# EAGLE design main (EAGLE 7.5.0)
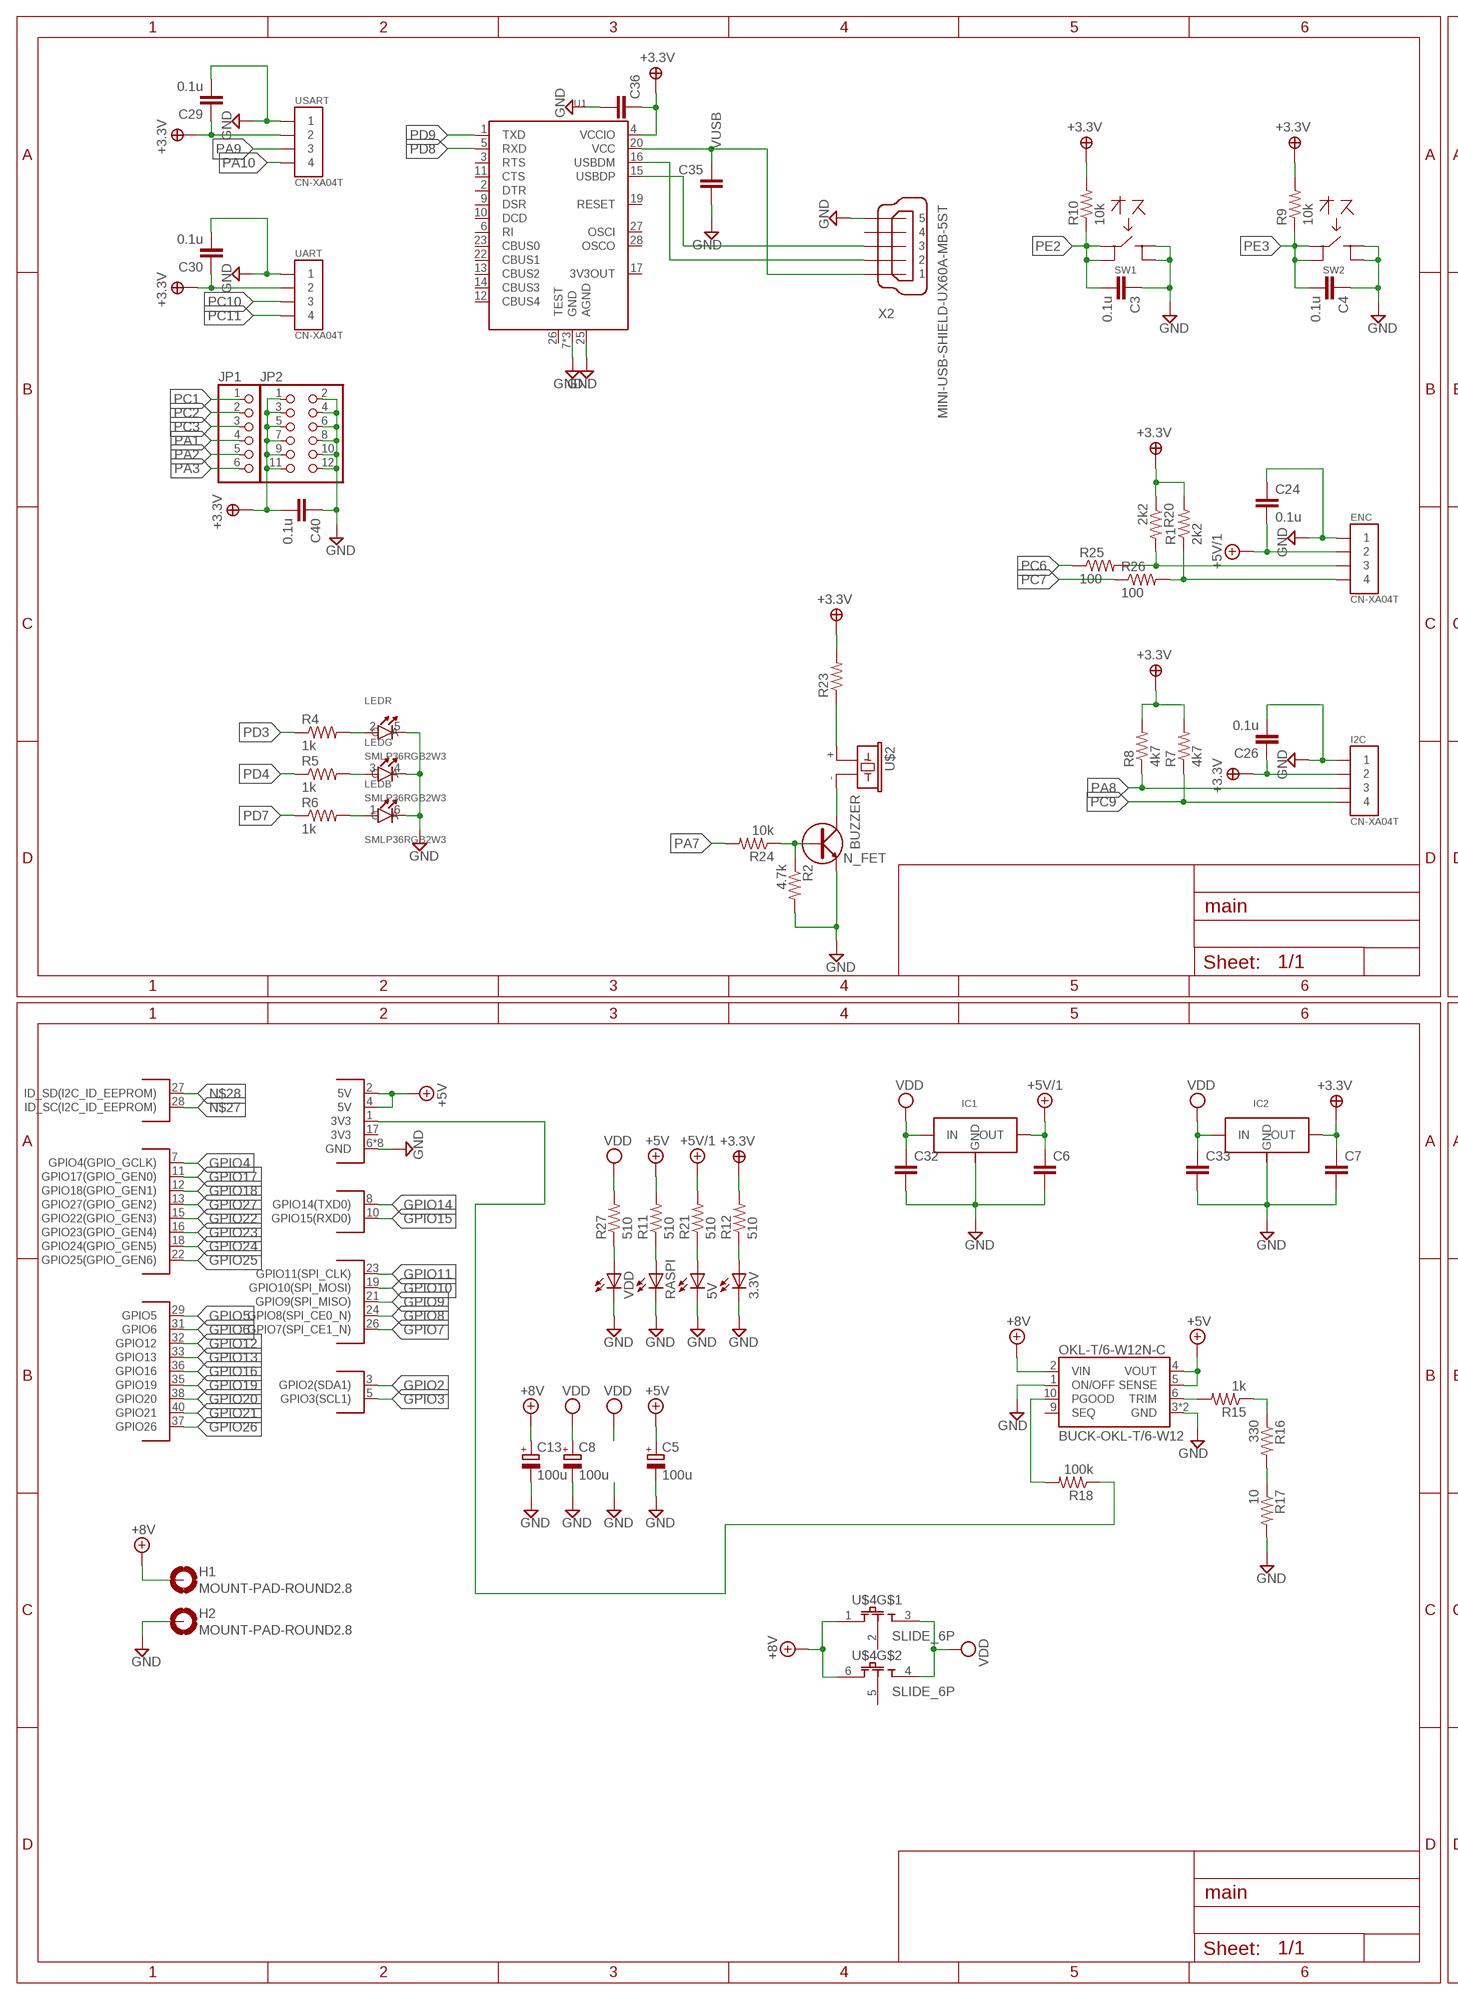
[diagram p0: schematic, sheet 1, part 1 of 2]
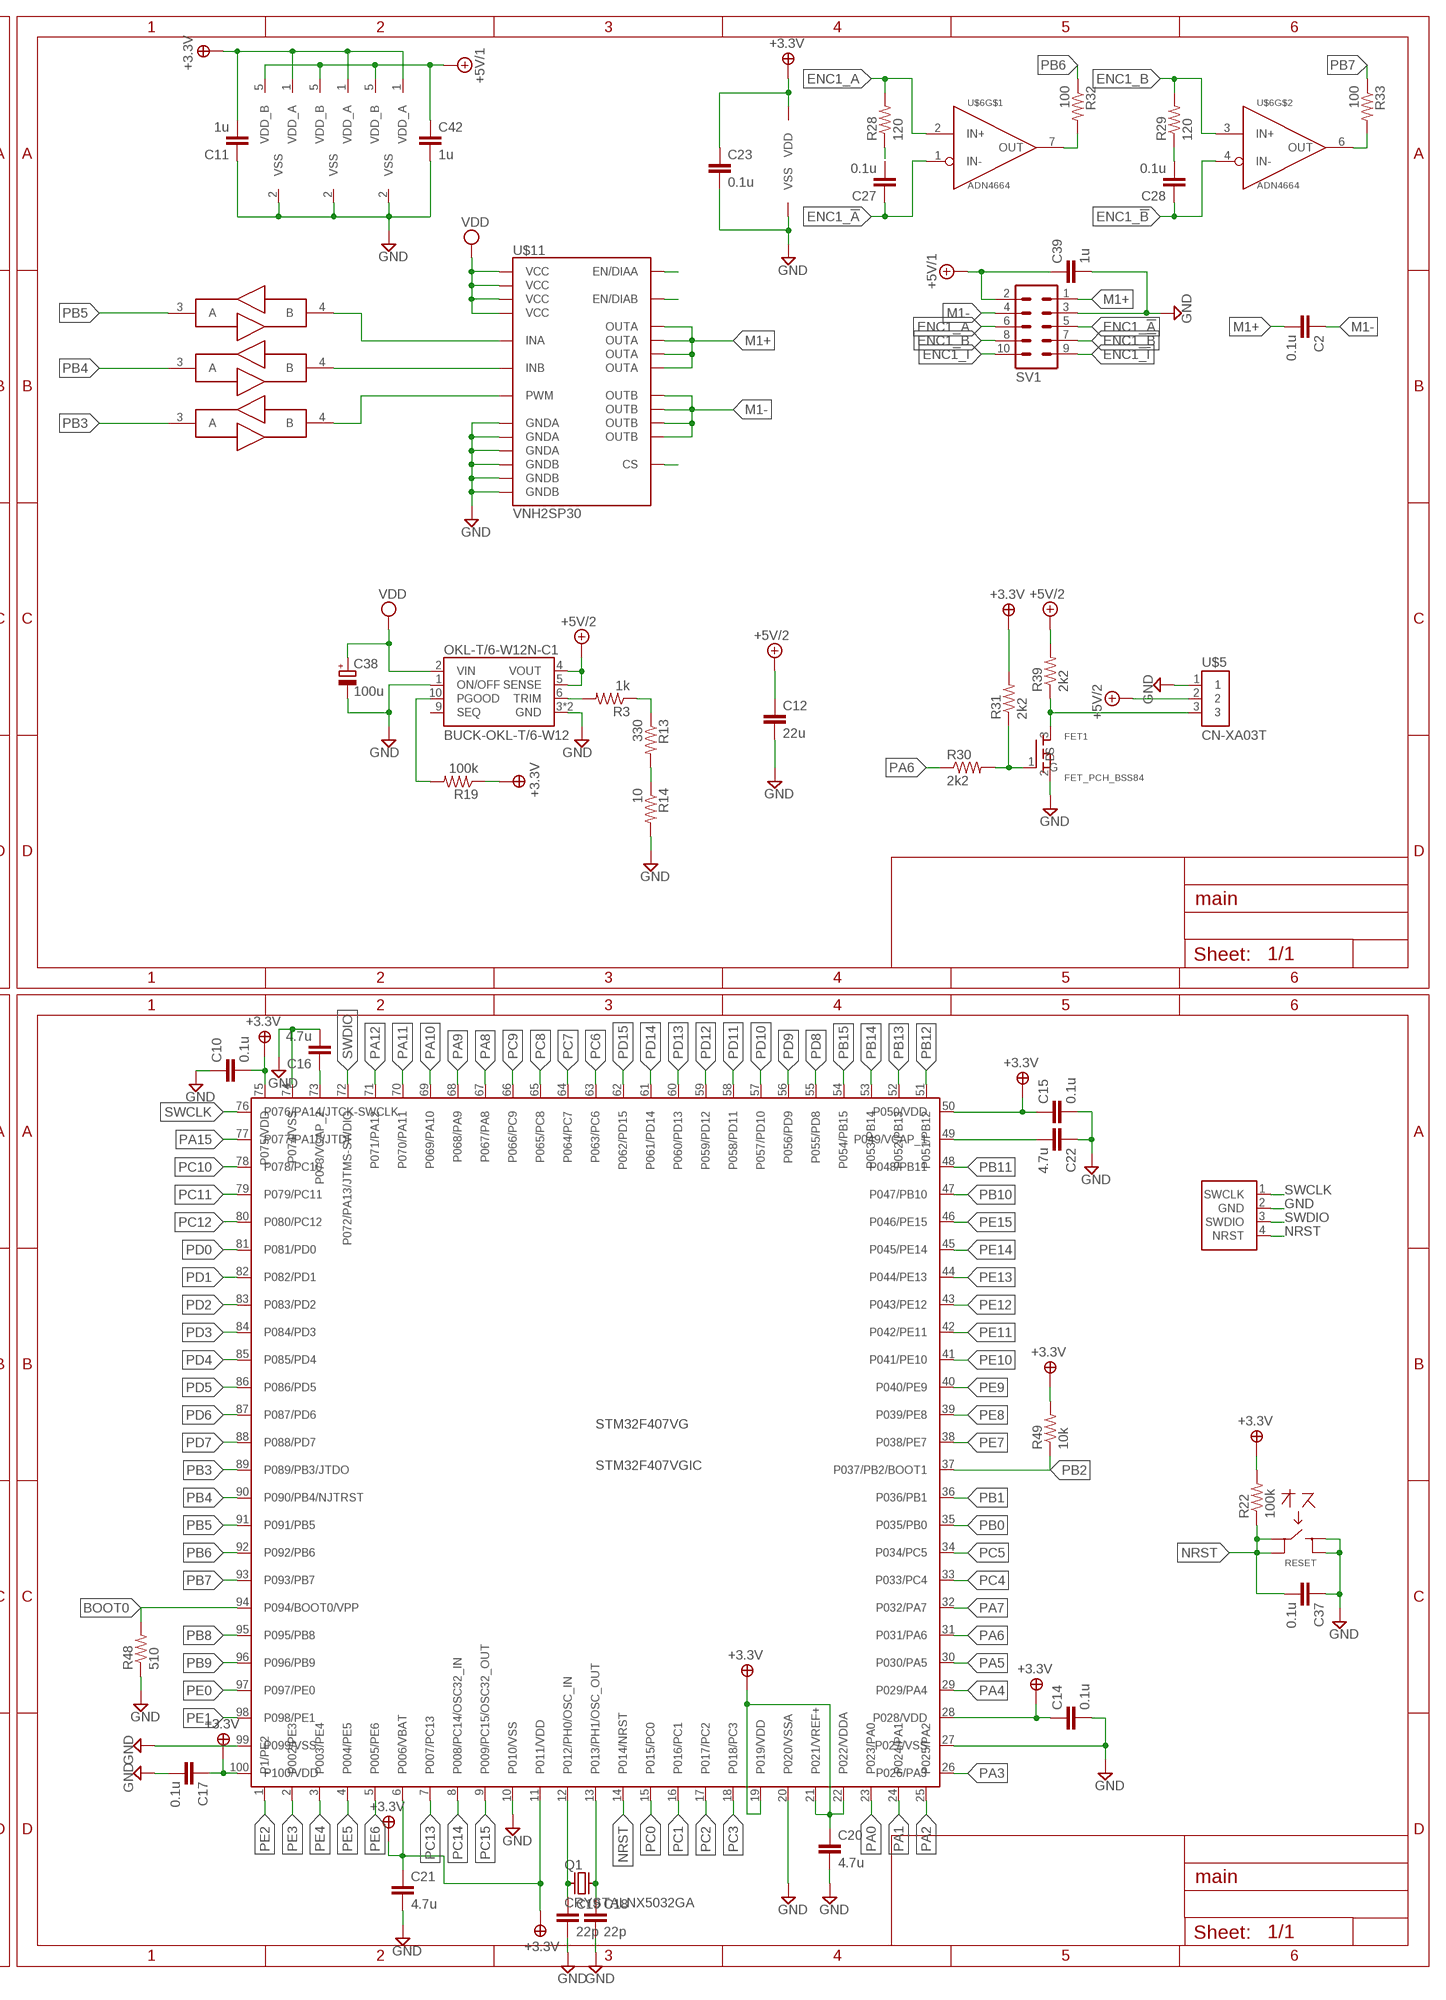
[diagram p1: schematic, sheet 1, part 2 of 2]

## Parts
3.3V  LEDCHIPLED_0603  [CHIPLED_0603]
5V  LEDCHIPLED_0603  [CHIPLED_0603]
C2  0.1u  C-EUC0603K  [C0603K]
C3  0.1u  C-EUC0603K  [C0603K]
C4  0.1u  C-EUC0603K  [C0603K]
C5  100u  CPOL-EUC  [PANASONIC_C]
C6  C-EUC0805K  [C0805K]
C7  C-EUC0805K  [C0805K]
C8  100u  CPOL-EUD  [PANASONIC_D]
C10  0.1u  C-EUC0603K  [C0603K]
C11  1u  C-EUC0603K  [C0603K]
C12  22u  C-EUC0805K  [C0805K]
C13  100u  CPOL-EUC  [PANASONIC_C]
C14  0.1u  C-EUC0603K  [C0603K]
C15  0.1u  C-EUC0603K  [C0603K]
C16  4.7u  C-EUC0805K  [C0805K]
C17  0.1u  C-EUC0603K  [C0603K]
C18  22p  C-EUC0603K  [C0603K]
C19  22p  C-EUC0603K  [C0603K]
C20  4.7u  C-EUC0805K  [C0805K]
C21  4.7u  C-EUC0805K  [C0805K]
C22  4.7u  C-EUC0805K  [C0805K]
C23  0.1u  C-EUC0603K  [C0603K]
C24  0.1u  C-EUC0805  [C0805]
C26  0.1u  C-EUC0805  [C0805]
C27  0.1u  C-EUC0603K  [C0603K]
C28  0.1u  C-EUC0603K  [C0603K]
C29  0.1u  C-EUC0805  [C0805]
C30  0.1u  C-EUC0805  [C0805]
C32  C-EUC0805K  [C0805K]
C33  C-EUC0805K  [C0805K]
C35  C-EUC0603K  [C0603K]
C36  C-EUC0603K  [C0603K]
C37  0.1u  C-EUC0603K  [C0603K]
C38  100u  CPOL-EUD  [PANASONIC_D]
C39  1u  C-EUC0603K  [C0603K]
C40  0.1u  C-EUC0805K  [C0805K]
C42  1u  C-EUC0603K  [C0603K]
ENC  CN-XA04T  [XA04]
FET1  FET_PCH_BSS84  [SOT-23-3]
H1  MOUNT-PAD-ROUND2.8  [2,8-PAD]
H2  MOUNT-PAD-ROUND2.8  [2,8-PAD]
I2C  CN-XA04T  [XA04]
IC1  REGULATERLM1058  [SOT-223]
IC2  REGULATERLM1058  [SOT-223]
JP1  PINHD-1X06_2.54-S  [1X06-S]
JP2  PINHD-2X06_2.54  [2X06]
LED  SMLP36RGB2W3  [0604(6PIN)]
N_FET  TR_NTR  [SOT-23-3]
OKL-T/6-W12N-C  BUCK-OKL-T/6-W12  [BUCK-OKL-T/6-W12]
OKL-T/6-W12N-C1  BUCK-OKL-T/6-W12  [BUCK-OKL-T/6-W12]
Q1  CRYSTALNX5032GA  [NX5032GA]
R1  2k2  R-US_R0603  [R0603]
R2  4.7k  R-US_R0603  [R0603]
R3  1k  R-US_R0603  [R0603]
R4  1k  R-US_R0402  [R0402]
R5  1k  R-US_R0402  [R0402]
R6  1k  R-US_R0402  [R0402]
R7  4k7  R-US_R0603  [R0603]
R8  4k7  R-US_R0603  [R0603]
R9  10k  R-US_R0603  [R0603]
R10  10k  R-US_R0603  [R0603]
R11  510  R-US_R0603  [R0603]
R12  510  R-US_R0603  [R0603]
R13  330  R-US_R0603  [R0603]
R14  10  R-US_R0603  [R0603]
R15  1k  R-US_R0603  [R0603]
R16  330  R-US_R0603  [R0603]
R17  10  R-US_R0603  [R0603]
R18  100k  R-US_R0603  [R0603]
R19  100k  R-US_R0603  [R0603]
R20  2k2  R-US_R0603  [R0603]
R21  510  R-US_R0603  [R0603]
R22  100k  R-US_R0603  [R0603]
R23  R-US_R0603  [R0603]
R24  10k  R-US_R0603  [R0603]
R25  100  R-US_R0603  [R0603]
R26  100  R-US_R0603  [R0603]
R27  510  R-US_R0603  [R0603]
R28  120  R-US_R0603  [R0603]
R29  120  R-US_R0603  [R0603]
R30  2k2  R-US_R0603  [R0603]
R31  2k2  R-US_R0603  [R0603]
R32  100  R-US_R0603  [R0603]
R33  100  R-US_R0603  [R0603]
R39  2k2  R-US_R0603  [R0603]
R48  510  R-US_R0603  [R0603]
R49  10k  R-US_R0603  [R0603]
RASPI  LEDCHIPLED_0603  [CHIPLED_0603]
RESET  SWITCH_4PALPS  [SKRP]
STM32F407VG  STM32F407VGIC  [LQFP100]
SV1  ML10_T  [ML10]
SW1  SWITCH_4PALPS  [SKRP]
SW2  SWITCH_4PALPS  [SKRP]
U1  FT232RL  [SSOP28]
U$1  RASPBERRY_PAI2_B  [PAI_2_B_RS]
U$2  BUZZER  [SMT-0440-S-R]
U$3  WRITE_FOR_STM32FXT  [ZH05]
U$4  SLIDE_6P  [SSW-SMD]
U$5  CN-XA03T  [XA03]
U$6  ADN4664  [SOIC8]
U$7  MAX3370  [SOT-353/SC-70-5]
U$9  MAX3370  [SOT-353/SC-70-5]
U$10  MAX3370  [SOT-353/SC-70-5]
U$11  VNH2SP30  [VNH2SP30]
UART  CN-XA04T  [XA04]
USART  CN-XA04T  [XA04]
VDD  LEDCHIPLED_0603  [CHIPLED_0603]
X2  MINI-USB-SHIELD-UX60A-MB-5ST  [UX60A-MB-5ST]

## Nets
3.3V: C7.1 C10.2 C11.2 C14.1 C15.1 C17.1 C20.1 C21.1 C23.1 C26.1 C29.1 C30.1 C36.1 C40.2 I2C.PIN2 IC2.2(OUT) IC2.4(OUT) JP2.1 JP2.3 JP2.5 JP2.7 JP2.9 JP2.11 R1.2 R7.2 R8.2 R9.2 R10.2 R12.2 R19.1 R20.1 R22.2 R23.2 R31.2 R49.2 STM32F407VG.6(P006/VBAT) STM32F407VG.11(P011/VDD) STM32F407VG.19(P019/VDD) STM32F407VG.21(P021/VREF+) STM32F407VG.22(P022/VDDA) STM32F407VG.28(P028/VDD) STM32F407VG.50(P050/VDD) STM32F407VG.75(P075/VDD) STM32F407VG.100(P100/VDD) U1.4(VCCIO) U$6.8(VDD) U$7.1(VDD_A) U$9.1(VDD_A) U$10.1(VDD_A) UART.PIN2 USART.PIN2 ; supply symbol labelled +3.3V
+5V: C5.+ OKL-T/6-W12N-C.4(VOUT) OKL-T/6-W12N-C.5(SENSE) R11.2 U$1.2(5V) U$1.4(5V)
+5V/1: C6.1 C24.2 C39.1 C42.1 ENC.PIN2 IC1.2(OUT) IC1.4(OUT) R21.2 SV1.2 U$7.5(VDD_B) U$9.5(VDD_B) U$10.5(VDD_B)
+5V/2: C12.1 OKL-T/6-W12N-C1.4(VOUT) OKL-T/6-W12N-C1.5(SENSE) R39.2 U$5.2
+8V: C13.+ H1.B2,8(MOUNT) OKL-T/6-W12N-C.2(VIN) U$4.1 U$4.6
BOOT0: R48.2 STM32F407VG.94(P094/BOOT0/VPP)
ENC1_!A: C27.1 SV1.5 U$6.1(IN-)
ENC1_!B: C28.1 SV1.7 U$6.4(IN-)
ENC1_!I: SV1.9
ENC1_A: R28.2 SV1.6 U$6.2(IN+)
ENC1_B: R29.2 SV1.8 U$6.3(IN+)
ENC1_I: SV1.10
GND: 3.3V.C 5V.C C3.1 C4.1 C5.- C6.2 C7.2 C8.- C10.1 C11.1 C12.2 C13.- C14.2 C15.2 C16.2 C17.2 C18.2 C19.2 C20.2 C21.2 C22.1 C23.2 C24.1 C26.2 C29.2 C30.2 C32.2 C33.2 C35.2 C36.2 C37.1 C38.- C39.2 C40.1 C42.2 ENC.PIN1 FET1.2(S) H2.B2,8(MOUNT) I2C.PIN1 IC1.1(GND) IC2.1(GND) JP2.2 JP2.4 JP2.6 JP2.8 JP2.10 JP2.12 LED.4(G:C) LED.5(R:C) LED.6(B:C) N_FET.2(E) OKL-T/6-W12N-C1.1(ON/OFF) OKL-T/6-W12N-C1.3(GND) OKL-T/6-W12N-C1.7(GND) OKL-T/6-W12N-C.1(ON/OFF) OKL-T/6-W12N-C.3(GND) OKL-T/6-W12N-C.7(GND) R2.2 R14.2 R17.2 R48.1 RASPI.C RESET.3 RESET.4 STM32F407VG.10(P010/VSS) STM32F407VG.20(P020/VSSA) STM32F407VG.27(P027/VSS) STM32F407VG.74(P074/VSS) STM32F407VG.99(P099/VSS) SV1.3 SW1.3 SW1.4 SW2.3 SW2.4 U1.7(GND) U1.18(GND) U1.21(GND) U1.25(AGND) U$1.6(GND) U$1.9(GND) U$1.14(GND) U$1.20(GND) U$1.25(GND) U$1.30(GND) U$1.34(GND) U$1.39(GND) U$3.2(GND) U$5.1 U$6.5(VSS) U$7.2(VSS) U$9.2(VSS) U$10.2(VSS) U$11.18(GNDB) U$11.19(GNDB) U$11.20(GNDB) U$11.26(GNDA) U$11.27(GNDA) U$11.28(GNDA) UART.PIN1 USART.PIN1 VDD.C X2.5
GPIO2: U$1.3(GPIO2(SDA1))
GPIO3: U$1.5(GPIO3(SCL1))
GPIO4: U$1.7(GPIO4(GPIO_GCLK))
GPIO5: U$1.29(GPIO5)
GPIO6: U$1.31(GPIO6)
GPIO7: U$1.26(GPIO7(SPI_CE1_N))
GPIO8: U$1.24(GPIO8(SPI_CE0_N))
GPIO9: U$1.21(GPIO9(SPI_MISO))
GPIO10: U$1.19(GPIO10(SPI_MOSI))
GPIO11: U$1.23(GPIO11(SPI_CLK))
GPIO12: U$1.32(GPIO12)
GPIO13: U$1.33(GPIO13)
GPIO14: U$1.8(GPIO14(TXD0))
GPIO15: U$1.10(GPIO15(RXD0))
GPIO16: U$1.36(GPIO16)
GPIO17: U$1.11(GPIO17(GPIO_GEN0))
GPIO18: U$1.12(GPIO18(GPIO_GEN1))
GPIO19: U$1.35(GPIO19)
GPIO20: U$1.38(GPIO20)
GPIO21: U$1.40(GPIO21)
GPIO22: U$1.15(GPIO22(GPIO_GEN3))
GPIO23: U$1.16(GPIO23(GPIO_GEN4))
GPIO24: U$1.18(GPIO24(GPIO_GEN5))
GPIO25: U$1.22(GPIO25(GPIO_GEN6))
GPIO26: U$1.37(GPIO26)
GPIO27: U$1.13(GPIO27(GPIO_GEN2))
M1+: C2.2 SV1.1 U$11.1(OUTA) U$11.25(OUTA) U$11.30(OUTA) U$11.SLUG3(OUTA)
M1-: C2.1 SV1.4 U$11.15(OUTB) U$11.16(OUTB) U$11.21(OUTB) U$11.SLUG2(OUTB)
N$1: ENC.PIN3 R20.2 R25.2
N$2: OKL-T/6-W12N-C1.6(TRIM) R3.2
N$3: LED.2(R:A) R4.2
N$4: LED.3(G:A) R5.2
N$5: LED.1(B:A) R6.2
N$6: N_FET.3(C) U$2.-
N$7: C16.1 STM32F407VG.73(P073/VCAP_2)
N$8: R23.1 U$2.+
N$9: R11.1 RASPI.A
N$10: R3.1 R13.1
N$11: N_FET.1(B) R2.1 R24.1
N$12: C27.2 R28.1
N$13: OKL-T/6-W12N-C.6(TRIM) R15.2
N$14: R13.2 R14.1
N$15: 3.3V.A R12.1
N$17: U$7.4(B) U$11.8(PWM)
N$18: U1.15(USBDP) X2.3
N$19: ENC.PIN4 R1.1 R26.2
N$20: U1.16(USBDM) X2.2
N$21: R15.1 R16.1
N$22: U$9.4(B) U$11.11(INB)
N$23: R16.2 R17.1
N$24: OKL-T/6-W12N-C.10(PGOOD) R18.2
N$25: C22.2 STM32F407VG.49(P049/VCAP_1)
N$26: 5V.A R21.1
N$27: U$1.28(ID_SC(I2C_ID_EEPROM))
N$28: U$1.27(ID_SD(I2C_ID_EEPROM))
N$29: R27.1 VDD.A
N$30: C28.2 R29.1
N$31: OKL-T/6-W12N-C1.10(PGOOD) R19.2
N$32: U$10.4(B) U$11.5(INA)
N$33: FET1.3(D) R39.1 U$5.3
N$34: U$11.9(CS)
N$37: FET1.1(G) R30.2 R31.1
N$40: R18.1 U$1.1(3V3)
N$41: U$11.10(EN/DIAB)
N$42: U$11.6(EN/DIAA)
N$47: R32.2 U$6.7(OUT)
N$48: R33.2 U$6.6(OUT)
NRST: C37.2 R22.1 RESET.1 RESET.2 STM32F407VG.14(P014/NRST) U$3.4(NRST)
PA0: STM32F407VG.23(P023/PA0)
PA1: JP1.4 STM32F407VG.24(P024/PA1)
PA2: JP1.5 STM32F407VG.25(P025/PA2)
PA3: JP1.6 STM32F407VG.26(P026/PA3)
PA4: STM32F407VG.29(P029/PA4)
PA5: STM32F407VG.30(P030/PA5)
PA6: R30.1 STM32F407VG.31(P031/PA6)
PA7: R24.2 STM32F407VG.32(P032/PA7)
PA8: I2C.PIN3 R8.1 STM32F407VG.67(P067/PA8)
PA9: STM32F407VG.68(P068/PA9) USART.PIN3
PA10: STM32F407VG.69(P069/PA10) USART.PIN4
PA11: STM32F407VG.70(P070/PA11)
PA12: STM32F407VG.71(P071/PA12)
PA15: STM32F407VG.77(P077/PA15/JTDI)
PB0: STM32F407VG.35(P035/PB0)
PB1: STM32F407VG.36(P036/PB1)
PB2: R49.1 STM32F407VG.37(P037/PB2/BOOT1)
PB3: STM32F407VG.89(P089/PB3/JTDO) U$7.3(A)
PB4: STM32F407VG.90(P090/PB4/NJTRST) U$9.3(A)
PB5: STM32F407VG.91(P091/PB5) U$10.3(A)
PB6: R32.1 STM32F407VG.92(P092/PB6)
PB7: R33.1 STM32F407VG.93(P093/PB7)
PB8: STM32F407VG.95(P095/PB8)
PB9: STM32F407VG.96(P096/PB9)
PB10: STM32F407VG.47(P047/PB10)
PB11: STM32F407VG.48(P048/PB11)
PB12: STM32F407VG.51(P051/PB12)
PB13: STM32F407VG.52(P052/PB13)
PB14: STM32F407VG.53(P053/PB14)
PB15: STM32F407VG.54(P054/PB15)
PC0: STM32F407VG.15(P015/PC0)
PC1: JP1.1 STM32F407VG.16(P016/PC1)
PC2: JP1.2 STM32F407VG.17(P017/PC2)
PC3: JP1.3 STM32F407VG.18(P018/PC3)
PC4: STM32F407VG.33(P033/PC4)
PC5: STM32F407VG.34(P034/PC5)
PC6: R25.1 STM32F407VG.63(P063/PC6)
PC7: R26.1 STM32F407VG.64(P064/PC7)
PC8: STM32F407VG.65(P065/PC8)
PC9: I2C.PIN4 R7.1 STM32F407VG.66(P066/PC9)
PC10: STM32F407VG.78(P078/PC10) UART.PIN3
PC11: STM32F407VG.79(P079/PC11) UART.PIN4
PC12: STM32F407VG.80(P080/PC12)
PC13: STM32F407VG.7(P007/PC13)
PC14: STM32F407VG.8(P008/PC14/OSC32_IN)
PC15: STM32F407VG.9(P009/PC15/OSC32_OUT)
PD0: STM32F407VG.81(P081/PD0)
PD1: STM32F407VG.82(P082/PD1)
PD2: STM32F407VG.83(P083/PD2)
PD3: R4.1 STM32F407VG.84(P084/PD3)
PD4: R5.1 STM32F407VG.85(P085/PD4)
PD5: STM32F407VG.86(P086/PD5)
PD6: STM32F407VG.87(P087/PD6)
PD7: R6.1 STM32F407VG.88(P088/PD7)
PD8: STM32F407VG.55(P055/PD8) U1.5(RXD)
PD9: STM32F407VG.56(P056/PD9) U1.1(TXD)
PD10: STM32F407VG.57(P057/PD10)
PD11: STM32F407VG.58(P058/PD11)
PD12: STM32F407VG.59(P059/PD12)
PD13: STM32F407VG.60(P060/PD13)
PD14: STM32F407VG.61(P061/PD14)
PD15: STM32F407VG.62(P062/PD15)
PE0: STM32F407VG.97(P097/PE0)
PE1: STM32F407VG.98(P098/PE1)
PE2: C3.2 R10.1 STM32F407VG.1(P1/PE2) SW1.1 SW1.2
PE3: C4.2 R9.1 STM32F407VG.2(P002/PE3) SW2.1 SW2.2
PE4: STM32F407VG.3(P003/PE4)
PE5: STM32F407VG.4(P004/PE5)
PE6: STM32F407VG.5(P005/PE6)
PE7: STM32F407VG.38(P038/PE7)
PE8: STM32F407VG.39(P039/PE8)
PE9: STM32F407VG.40(P040/PE9)
PE10: STM32F407VG.41(P041/PE10)
PE11: STM32F407VG.42(P042/PE11)
PE12: STM32F407VG.43(P043/PE12)
PE13: STM32F407VG.44(P044/PE13)
PE14: STM32F407VG.45(P045/PE14)
PE15: STM32F407VG.46(P046/PE15)
PH0: C19.1 Q1.1 STM32F407VG.12(P012/PH0/OSC_IN)
PH1: C18.1 Q1.2 STM32F407VG.13(P013/PH1/OSC_OUT)
SWCLK: STM32F407VG.76(P076/PA14/JTCK-SWCLK) U$3.1(SWCLK)
SWDIO: STM32F407VG.72(P072/PA13/JTMS-SWDIO) U$3.3(SWDIO)
VDD: C8.+ C32.1 C33.1 C38.+ IC1.3(IN) IC2.3(IN) OKL-T/6-W12N-C1.2(VIN) R27.2 U$4.3 U$4.4 U$11.3(VCC) U$11.13(VCC) U$11.23(VCC) U$11.SLUG1(VCC)
VUSB: C35.1 U1.20(VCC) X2.1
Unconnected: OKL-T/6-W12N-C1.9(SEQ) OKL-T/6-W12N-C.9(SEQ) U1.2(DTR) U1.3(RTS) U1.6(RI) U1.9(DSR) U1.10(DCD) U1.11(CTS) U1.12(CBUS4) U1.13(CBUS2) U1.14(CBUS3) U1.17(3V3OUT) U1.19(RESET) U1.22(CBUS1) U1.23(CBUS0) U1.26(TEST) U1.27(OSCI) U1.28(OSCO) U$1.17(3V3) U$4.2 U$4.5 X2.4 X2.M1(S1) X2.M2(S2) X2.M3(S3) X2.M4(S4)

## Library data of the parts
3.3V 5V RASPI VDD = led:LED: LED OSRAM: - CHIPLED LG R971, LG N971, LY N971, LG Q971, LY Q971, LO R971, LY R971 LH N974, LH R974 LS Q976, LO Q976, LY Q976 LO Q996 - Hyper CHIPLED LW Q18S LB Q993, LB Q99A, LB R99A - SideLED LS A670, LO A670, LY A670, LG A670, LP A670 LB A673, LV A673, LT A673, LW A673 LH A674 LY A675 LS A676, LA A676, LO A676, LY A676, LW A676 LS A679, LY A679, LG A679 - Hyper Micro SIDELED® LS Y876, LA Y876, LO Y876, LY Y876 LT Y87S - SmartLED LW L88C, LW L88S LB L89C, LB L89S, LG L890 LS L89K, LO L89K, LY L89K LS L896, LA L896, LO L896, LY L896 - TOPLED LS T670, LO T670, LY T670, LG T670, LP T670 LSG T670, LSP T670, LSY T670, LOP T670, LYG T670 LG T671, LOG T671, LSG T671 LB T673, LV T673, LT T673, LW T673 LH T674 LS T676, LA T676, LO T676, LY T676, LB T676, LH T676, LSB T676, LW T676 LB T67C, LV T67C, LT T67C, LS T67K, LO T67K, LY T67K, LW E67C LS E67B, LA E67B, LO E67B, LY E67B, LB E67C, LV E67C, LT E67C LW T67C LS T679, LY T679, LG T679 LS T770, LO T770, LY T770, LG T770, LP T770 LB T773, LV T773, LT T773, LW T773 LH T774 LS E675, LA E675, LY E675, LS T675 LS T776, LA T776, LO T776, LY T776, LB T776 LHGB T686 LT T68C, LB T68C - Hyper Mini TOPLED® LB M676 - Mini TOPLED Santana® LG M470 LS M47K, LO M47K, LY M47K Source: http://www.osram.convergy.de LUXEON: - LUMILED® LXK2-PW12-R00, LXK2-PW12-S00, LXK2-PW14-U00, LXK2-PW14-V00 LXK2-PM12-R00, LXK2-PM12-S00, LXK2-PM14-U00 LXK2-PE12-Q00, LXK2-PE12-R00, LXK2-PE12-S00, LXK2-PE14-T00, LXK2-PE14-U00 LXK2-PB12-K00, LXK2-PB12-L00, LXK2-PB12-M00, LXK2-PB14-N00, LXK2-PB14-P00, LXK2-PB14-Q00 LXK2-PR12-L00, LXK2-PR12-M00, LXK2-PR14-Q00, LXK2-PR14-R00 LXK2-PD12-Q00, LXK2-PD12-R00, LXK2-PD12-S00 LXK2-PH12-R00, LXK2-PH12-S00 LXK2-PL12-P00, LXK2-PL12-Q00, LXK2-PL12-R00 Source: www.luxeon.com KINGBRIGHT: KA-3528ASYC Source: www.kingbright.com
C2-C4 C6 C7 C10-C12 C14-C24 C26-C30 C32 C33 C35-C37 C39 C40 C42 = rp_c:C-EU: CAPACITOR, European symbol
C5 C8 C13 C38 = rcl:CPOL-EU: POLARIZED CAPACITOR, European symbol
ENC I2C UART USART = Shohei:CN-XA04
FET1 = Syohei:FET_PCH
H1 H2 = holes:MOUNT-PAD-ROUND: MOUNTING PAD, round
IC1 IC2 = Syohei:REGULATER
JP1 = pinhead-2:PINHD-1X06: PIN HEADER
JP2 = pinhead-2:PINHD-2X06: PIN HEADER
LED = Syohei:SMLP36RGB2W3
N_FET = Syohei:TR_N
OKL-T/6-W12N-C OKL-T/6-W12N-C1 = Syohei:BUCK-OKL-T/6-W12
Q1 = Syohei:CRYSTAL
R1-R33 R39 R48 R49 = rp_r:R-US_: RESISTOR, American symbol
RESET SW1 SW2 = Syohei:SWITCH_4P
STM32F407VG = Syohei:STM32F407VG
SV1 = Syohei:ML10: HARTING
U1 = Syohei:FT232
U$1 = Raspberry_pai:RASPBERRY_PAI2_B
U$2 = Syohei:BUZZER
U$3 = Syohei:WRITE_FOR_STM32FX
U$4 = Shohei:SLIDE_6P
U$5 = Syohei:CN-XA03
U$6 = Syohei:ADN4664
U$7 U$9 U$10 = Syohei:MAX3370
U$11 = Shohei:VNH2SP30
X2 = Shohei:MINI-USB-SHIELD-: MINI USB Connector Source: http://www.hirose.co.jp/cataloge_hp/e24000019.pdf; OC_FARNELL: unknown; OC_NEWARK: unknown

## Board
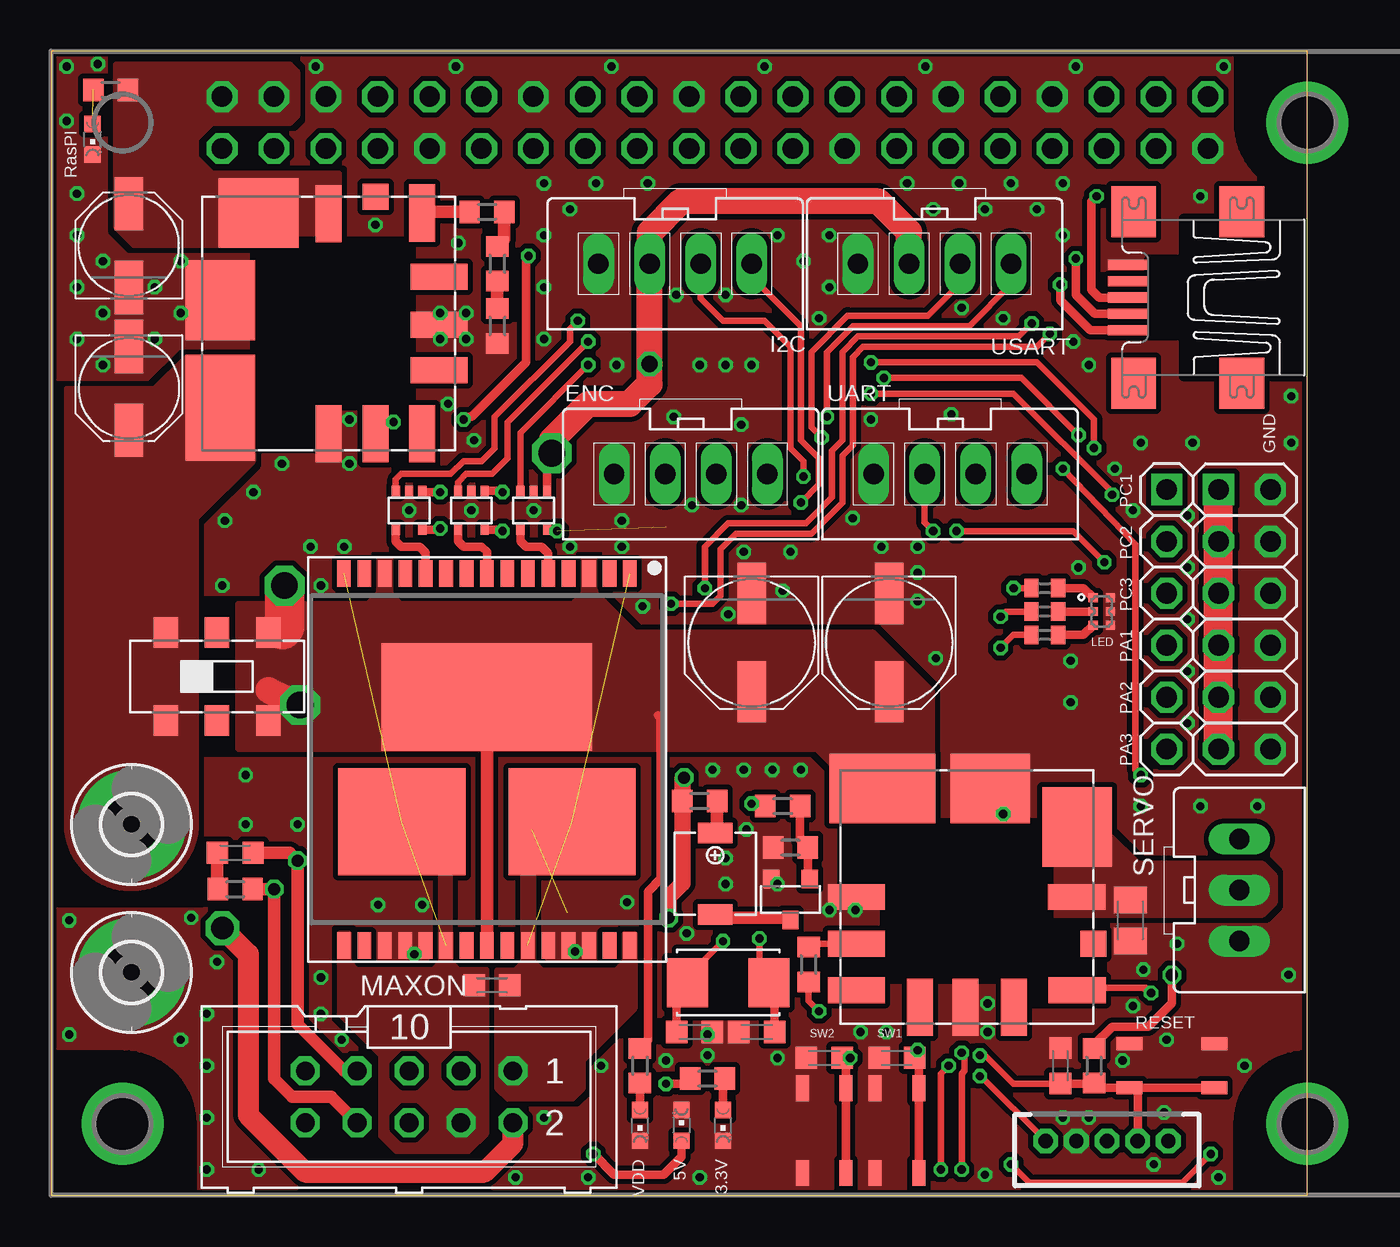
[diagram p2: board, top side]
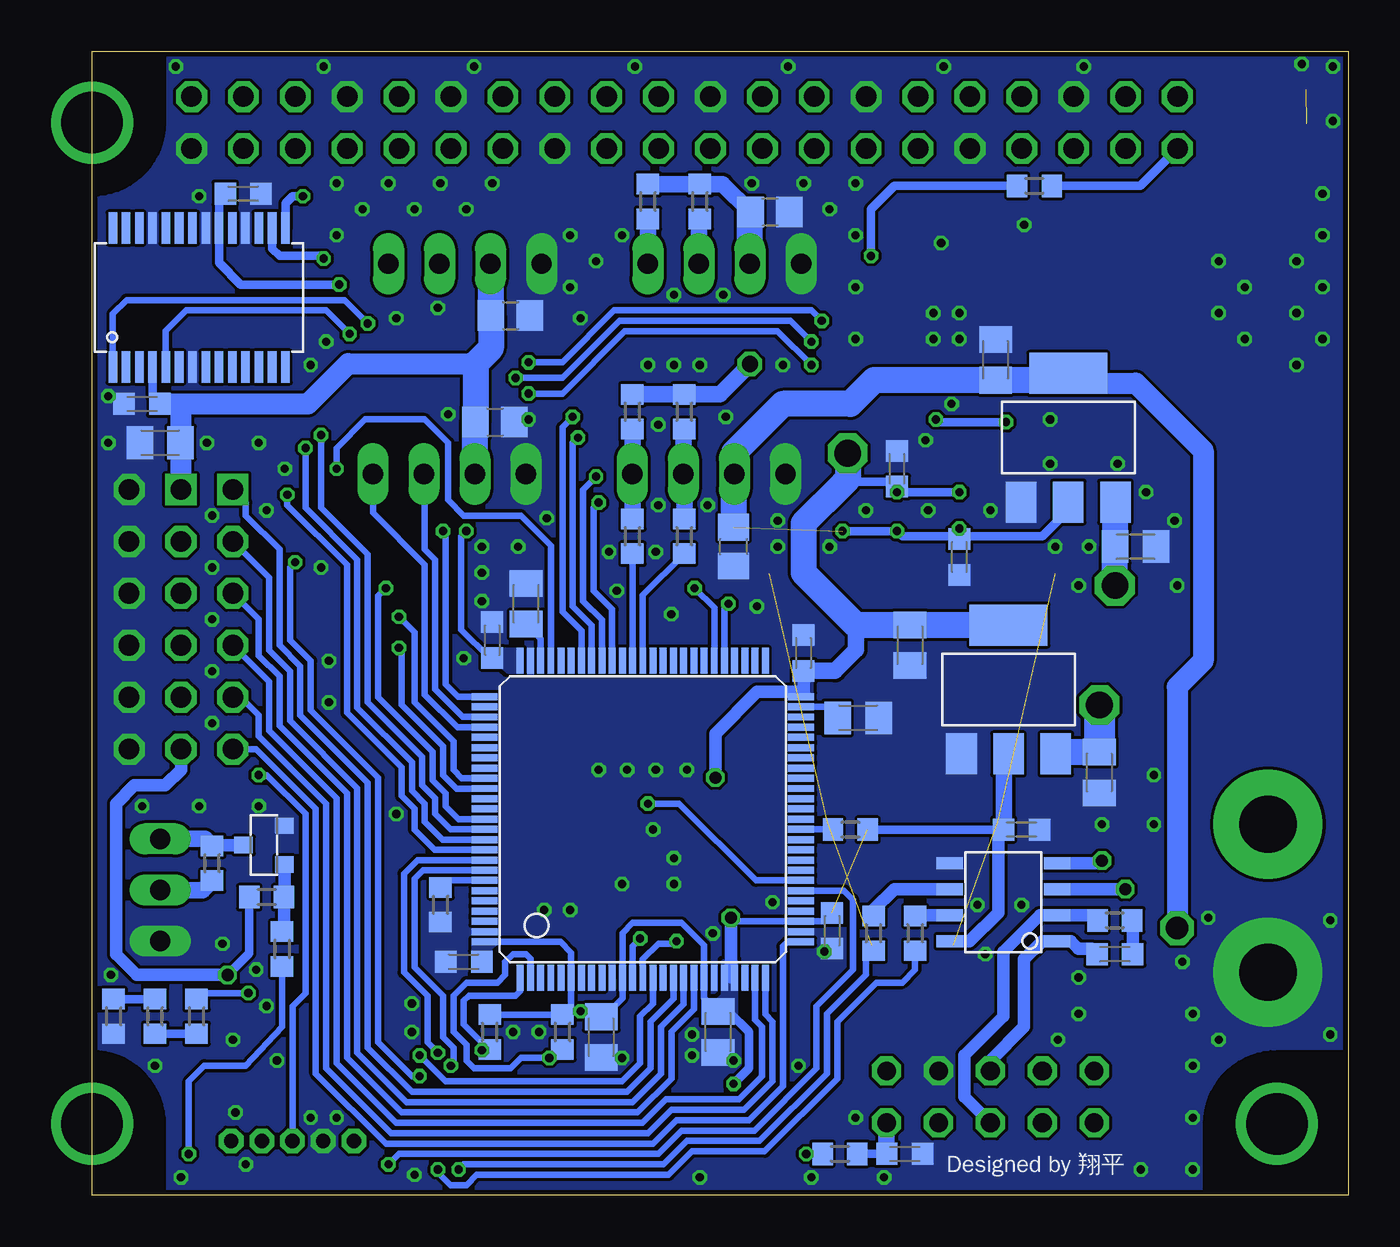
[diagram p3: board, bottom side, seen from below]

Size 61.5 x 56 mm. Coordinates in mm from the lower left corner, seen from the top.
Outline: 0,0 61.5,0 61.5,56 0,56 0,0
Copper layers (1*16): Top 0.035mm / dielectric 1.5mm / Bottom 0.035mm
Design rules "Elecrow_2-layer_eagle_rule": minimum track width 6mil, minimum drill 12mil, track to track 6mil, track to pad 6mil, pad to pad 6mil, via to via 6mil, smd to smd 0mil, copper to edge 10mil, drill to drill 10mil, minimum pad ring 10mil, minimum via ring 6mil, stop-mask expansion 2mil, vias tented up to drill 100mil, thermal gap 10mil
tRestrict: 5 lines

### Footprints (pad centres in the part's own frame; a part is rotated, then mirrored left to right if it is on the bottom)
CHIPLED_0603 = smd 0.8 x 0.8: A 0,-0.75; C 0,0.75
C0603K = smd 1.05 x 1.08: 1 -0.875,0; 2 0.875,0
PANASONIC_C = smd 2.6 x 1.4: + 2.05,0; - -2.05,0
C0805K = smd 1.3 x 1.6: 1 -1,0; 2 1,0
PANASONIC_D = smd 3 x 1.4: + 2.4,0; - -2.4,0
C0805 = smd 1.3 x 1.5: 1 -0.95,0; 2 0.95,0
XA04 = drill 1 long: PIN1 0,0; PIN2 -2.5,0; PIN3 -5,0; PIN4 -7.5,0
SOT-23-3 = smd 0.8 x 0.9: 1 -0.95,-1; 2 0.95,-1; 3 0,1
2,8-PAD = drill 2.8 pad 5.334: B2,8 0,0
SOT-223 = smd 1.499 x 2.007: 1 -2.311,-3.15; 2 0,-3.15; 3 2.311,-3.15 | smd 3.81 x 2.007: 4 0,3.15
1X06-S = drill 1.016 square: 1 -6.35,0 | drill 1.016 octagon: 2 -3.81,0; 3 -1.27,0; 4 1.27,0; 5 3.81,0; 6 6.35,0
2X06 = drill 1.016 square: 1 -6.35,-1.27 | drill 1.016 octagon: 2 -6.35,1.27; 3 -3.81,-1.27; 4 -3.81,1.27; 5 -1.27,-1.27; 6 -1.27,1.27; 7 1.27,-1.27; 8 1.27,1.27; 9 3.81,-1.27; 10 3.81,1.27; 11 6.35,-1.27; 12 6.35,1.27
0604(6PIN) = smd 0.45 x 0.45: 1 -0.675,-0.425; 3 0.675,-0.425; 4 0.675,0.425; 6 -0.675,0.425 | smd 0.4 x 0.45: 2 0,-0.425; 5 0,0.425
BUCK-OKL-T/6-W12 = smd 2.8 x 1.27: 1 -5.4,0; 5 5.37,0; 6 5.4,-4.57; 9 -5.4,-4.57; 10 -5.4,-2.29 | smd 5.2 x 3.4: 2 -4.13,5.3 | smd 3.9 x 3.4: 3 1.14,5.3 | smd 3.4 x 3.9: 4 5.4,3.43 | smd 1.27 x 2.8: 7 -0.07,-5.4; 8 -2.29,-5.4; 12 2.29,-5.4 | smd 1.27 x 1.27: 11 6.2,-2.29
NX5032GA = smd 2 x 2.4: 1 -2,0; 2 2,0
R0603 = smd 1 x 1.1: 1 -0.85,0; 2 0.85,0
R0402 = smd 0.7 x 0.9: 1 -0.65,0; 2 0.65,0
SKRP = smd 1.27 x 0.635: 1 -2.075,1.075; 2 2.075,1.075; 3 -2.075,-1.075; 4 2.075,-1.075
LQFP100 = smd 0.34 x 1.27: 1 -6,-7.75; 2 -5.5,-7.75; 3 -5,-7.75; 4 -4.5,-7.75; 5 -4,-7.75; 6 -3.5,-7.75; 7 -3,-7.75; 8 -2.5,-7.75; 9 -2,-7.75; 10 -1.5,-7.75; 11 -1,-7.75; 12 -0.5,-7.75; 13 0,-7.75; 14 0.5,-7.75; 15 1,-7.75; 16 1.5,-7.75; 17 2,-7.75; 18 2.5,-7.75; 19 3,-7.75; 20 3.5,-7.75; 21 4,-7.75; 22 4.5,-7.75; 23 5,-7.75; 24 5.5,-7.75; 25 6,-7.75; 51 6,7.75; 52 5.5,7.75; 53 5,7.75; 54 4.5,7.75; 55 4,7.75; 56 3.5,7.75; 57 3,7.75; 58 2.5,7.75; 59 2,7.75; 60 1.5,7.75; 61 1,7.75; 62 0.5,7.75; 63 0,7.75; 64 -0.5,7.75; 65 -1,7.75; 66 -1.5,7.75; 67 -2,7.75; 68 -2.5,7.75; 69 -3,7.75; 70 -3.5,7.75; 71 -4,7.75; 72 -4.5,7.75; 73 -5,7.75; 74 -5.5,7.75; 75 -6,7.75 | smd 1.27 x 0.34: 26 7.75,-6; 27 7.75,-5.5; 28 7.75,-5; 29 7.75,-4.5; 30 7.75,-4; 31 7.75,-3.5; 32 7.75,-3; 33 7.75,-2.5; 34 7.75,-2; 35 7.75,-1.5; 36 7.75,-1; 37 7.75,-0.5; 38 7.75,0; 39 7.75,0.5; 40 7.75,1; 41 7.75,1.5; 42 7.75,2; 43 7.75,2.5; 44 7.75,3; 45 7.75,3.5; 46 7.75,4; 47 7.75,4.5; 48 7.75,5; 49 7.75,5.5; 50 7.75,6; 76 -7.75,6; 77 -7.75,5.5; 78 -7.75,5; 79 -7.75,4.5; 80 -7.75,4; 81 -7.75,3.5; 82 -7.75,3; 83 -7.75,2.5; 84 -7.75,2; 85 -7.75,1.5; 86 -7.75,1; 87 -7.75,0.5; 88 -7.75,0; 89 -7.75,-0.5; 90 -7.75,-1; 91 -7.75,-1.5; 92 -7.75,-2; 93 -7.75,-2.5; 94 -7.75,-3; 95 -7.75,-3.5; 96 -7.75,-4; 97 -7.75,-4.5; 98 -7.75,-5; 99 -7.75,-5.5; 100 -7.75,-6
ML10 = drill 0.914 octagon: 1 -5.08,-1.27; 2 -5.08,1.27; 3 -2.54,-1.27; 4 -2.54,1.27; 5 0,-1.27; 6 0,1.27; 7 2.54,-1.27; 8 2.54,1.27; 9 5.08,-1.27; 10 5.08,1.27
SSOP28 = smd 0.42 x 1.524: 1 -4.225,-3.402; 2 -3.575,-3.402; 3 -2.925,-3.402; 4 -2.275,-3.402; 5 -1.625,-3.402; 6 -0.975,-3.402; 7 -0.325,-3.402; 8 0.325,-3.402; 9 0.975,-3.402; 10 1.625,-3.402; 11 2.275,-3.402; 12 2.925,-3.402; 13 3.575,-3.402; 14 4.225,-3.402; 15 4.225,3.402; 16 3.575,3.402; 17 2.925,3.402; 18 2.275,3.402; 19 1.625,3.402; 20 0.975,3.402; 21 0.325,3.402; 22 -0.325,3.402; 23 -0.975,3.402; 24 -1.625,3.402; 25 -2.275,3.402; 26 -2.925,3.402; 27 -3.575,3.402; 28 -4.225,3.402
PAI_2_B_RS = drill 1 pad 1.5 octagon: 1 8.37,51.23; 2 8.37,53.77; 3 10.91,51.23; 4 10.91,53.77; 5 13.45,51.23; 6 13.45,53.77; 7 15.99,51.23; 8 15.99,53.77; 9 18.53,51.23; 10 18.53,53.77; 11 21.07,51.23; 12 21.07,53.77; 13 23.61,51.23; 14 23.61,53.77; 15 26.15,51.23; 16 26.15,53.77; 17 28.69,51.23; 18 28.69,53.77; 19 31.23,51.23; 20 31.23,53.77; 21 33.77,51.23; 22 33.77,53.77; 23 36.31,51.23; 24 36.31,53.77; 25 38.85,51.23; 26 38.85,53.77; 27 41.39,51.23; 28 41.39,53.77; 29 43.93,51.23; 30 43.93,53.77; 31 46.47,51.23; 32 46.47,53.77; 33 49.01,51.23; 34 49.01,53.77; 35 51.55,51.23; 36 51.55,53.77; 37 54.09,51.23; 38 54.09,53.77; 39 56.63,51.23; 40 56.63,53.77
SMT-0440-S-R = smd 1 x 1.68: + -2,0; - 2,0
ZH05 = drill 0.7 octagon: 1 3,0; 2 1.5,0; 3 0,0; 4 -1.5,0; 5 -3,0
SSW-SMD = smd 1.2 x 1.5: 1 -2.5,-2.15; 2 0,-2.15; 3 2.5,-2.15; 4 2.5,2.15; 5 0,2.15; 6 -2.5,2.15
XA03 = drill 1 long: 1 0,0; 2 -2.5,0; 3 -5,0
SOIC8 = smd 0.6 x 1.3: 1 -1.905,-2.625; 2 -0.635,-2.625; 3 0.635,-2.625; 4 1.905,-2.625; 5 1.905,2.625; 6 0.635,2.625; 7 -0.635,2.625; 8 -1.905,2.625
SOT-353/SC-70-5 = smd 0.4 x 0.5: 1 -0.65,-0.95; 2 0,-0.95; 3 0.65,-0.95; 4 0.65,0.95; 5 -0.65,0.95
VNH2SP30 = smd 0.67 x 1.3: 1 -7,-9.1; 2 -6,-9.1; 3 -5,-9.1; 4 -4,-9.1; 5 -3,-9.1; 6 -2,-9.1; 7 -1,-9.1; 8 0,-9.1; 9 1,-9.1; 10 2,-9.1; 11 3,-9.1; 12 4,-9.1; 13 5,-9.1; 14 6,-9.1; 15 7,-9.1; 16 7,9.1; 17 6,9.1; 18 5,9.1; 19 4,9.1; 20 3,9.1; 21 2,9.1; 22 1,9.1; 23 0,9.1; 24 -1,9.1; 25 -2,9.1; 26 -3,9.1; 27 -4,9.1; 28 -5,9.1; 29 -6,9.1; 30 -7,9.1 | smd 10.3 x 5.25: SLUG1 0,-3.05 | smd 6.23 x 5.25: SLUG2 4.165,3.05; SLUG3 -4.165,3.05
UX60A-MB-5ST = smd 2 x 0.5: 1 2.25,1.6; 2 2.25,0.8; 3 2.25,0; 4 2.25,-0.8; 5 2.25,-1.6 | smd 2.2 x 2.5: M1 -3.3,-4.2; M2 -3.3,4.2; M3 2,4.2; M4 2,-4.2

### Placement (x,y rotation side)
3.3V  32.89,3.43 180 top
5V  30.86,3.43 0 top
C2  21.59,10.29 0 top
C3  41.4,6.73 0 top
C4  37.85,6.73 0 top
C5  3.81,46.48 90 top
C6  17.27,40.89 90 bottom
C7  21.46,26.92 270 bottom
C8  41.02,27.05 270 top
C10  41.91,27.18 270 bottom
C11  22.1,35.56 270 bottom
C12  52.83,13.46 270 top
C13  3.81,39.5 270 top
C14  25.27,12.95 270 bottom
C15  26.67,26.54 90 bottom
C16  40.26,28.96 90 bottom
C17  43.31,11.43 180 bottom
C18  31.5,8 0 top
C19  34.54,8 180 top
C20  30.86,8 270 bottom
C21  36.58,7.75 270 bottom
C22  24,23.37 180 bottom
C23  16,17.91 0 bottom
C24  30.1,31.75 90 bottom
C26  28.32,48.13 0 bottom
C27  11.43,11.81 0 bottom
C28  9.02,16.76 180 top
C29  41.02,43.05 0 bottom
C30  41.78,37.85 0 bottom
C32  10.41,31.75 0 bottom
C33  12.19,20.7 270 bottom
C35  54.1,49.02 0 bottom
C36  59.05,38.73 180 bottom
C37  49.4,6.35 270 top
C38  34.29,27.05 270 top
C39  21.72,2.03 0 bottom
C40  58.17,36.83 0 bottom
C42  19.05,31.24 270 bottom
ENC  27.56,35.31 180 top
FET1  53.09,17.14 90 bottom
H1  3.94,18.16 0 top
H2  3.94,10.92 0 top
I2C  26.8,45.59 180 top
IC1  13.72,37.08 0 bottom
IC2  16.64,24.77 0 bottom
JP1  54.61,28.19 270 top
JP2  58.42,28.19 270 top
LED  51.44,28.57 270 top
N_FET  36.2,14.48 180 top
OKL-T/6-W12N-C  13.59,42.67 90 top
OKL-T/6-W12N-C1  44.83,14.61 0 top
Q1  33.15,10.41 180 top
R1  35.05,38.35 90 bottom
R2  36.2,17.02 180 top
R3  56.39,8.76 90 bottom
R4  48.64,28.57 0 top
R5  48.64,27.43 0 top
R6  48.64,29.72 0 top
R7  34.29,48.64 90 bottom
R8  31.75,48.64 90 bottom
R9  38.48,8 90 bottom
R10  42.04,8 90 bottom
R11  2.92,54.1 0 top
R12  32.13,5.71 180 top
R13  58.42,8.76 90 bottom
R14  60.45,8.76 270 bottom
R15  21.34,48.13 180 top
R16  21.84,45.59 270 top
R17  21.84,42.55 270 top
R18  15.37,49.4 180 bottom
R19  37.08,11.3 90 top
R20  32.51,38.35 270 bottom
R21  24.89,2.03 0 bottom
R22  51.05,6.35 90 top
R23  31.75,19.3 180 top
R24  35.81,19.05 180 top
R25  32.51,32.26 90 bottom
R26  35.05,32.26 90 bottom
R27  28.83,6.35 90 top
R28  11.43,13.46 180 bottom
R29  9.02,14.99 0 top
R30  52.2,12.06 90 bottom
R31  52.96,14.61 180 bottom
R32  21.21,12.83 90 bottom
R33  23.24,12.83 90 bottom
R39  55.63,16.26 270 bottom
R48  44.45,14.22 90 bottom
R49  24.38,17.91 0 bottom
RASPI  2.03,51.69 180 top
RESET  54.86,6.35 180 top
STM32F407VG  34.54,18.41 0 bottom
SV1  17.53,4.83 180 top
SW1  41.4,3.17 270 top
SW2  37.85,3.17 270 top
U1  56.26,43.94 0 bottom
U$1  0,0 0 top
U$2  32.51,15.75 270 top
U$3  51.69,2.67 180 top
U$4  8.13,25.4 0 top
U$5  58.17,12.45 270 top
U$6  16.89,14.35 90 bottom
U$7  20.57,33.53 180 top
U$9  17.53,33.53 180 top
U$10  23.62,33.53 180 top
U$11  21.34,21.34 180 top
UART  40.26,35.31 180 top
USART  39.5,45.59 180 top
VDD  28.83,3.43 180 top
X2  54.99,43.94 180 top

### Tracks (layer width: path | path; a pad name or v marks a point on that pad's centre or on a via)
3.3V  (via drill 0.4, 0.6, 0.8, 1.3)  (1 unrouted)
  Top 0.33: R19.1 37.08,9.53 v37.59,9.02 | UART.PIN2 42.76,32.93 v43.18,32.51
  Top 0.406: U$10.1 24.27,35.7 v24.51,36.32 | v22.1,34.42 22.04,34.48 U$7.1 | U$9.1 18.24,34.42 v19.05,34.42 | R12.2 31.03,5.46 v30.1,5.46 | v54.86,10.79 54.86,9.4 53.72,8.26 51.94,8.26 51.05,7.37 R22.2
  Top 0.813: v30.99,20.45 30.9,20.41 R23.2 30.9,15.28 30.23,14.61 v30.23,13.59
  Top 1.27: v24.51,36.32 24.51,36.96 26.29,38.73 28.32,38.73 29.3,39.71 v29.3,40.68 I2C.PIN2 29.3,47.12 30.82,48.64 40.51,48.64 42,47.16 USART.PIN2
  Top 1.422: JP2.11 JP2.9 JP2.7 JP2.5 JP2.3 JP2.1
  Bottom 0.33: C20.1 31.54,9.68 STM32F407VG.19 31.54,12.24 32.64,13.34 35.05,13.34 35.54,12.84 STM32F407VG.11 35.54,9.65 36.45,8.75 C21.1 36.72,9.02 v37.59,9.02 | C14.1 25.69,13.41 STM32F407VG.28 30.02,13.41 v30.23,13.59 | 31.03,20.41 v30.99,20.45 | v37.59,9.02 38.31,9.02 R9.2 R10.2 | v37.59,9.02 38.04,9.02 STM32F407VG.6 38.04,11.88 38.58,12.41 STM32F407VG.100 | v43.18,32.51 43.43,32.26 43.43,27.69 42.05,26.3 C10.2
  Bottom 0.406: v19.05,34.42 v22.1,34.42 C11.2 22.34,34.92 24.64,34.92 24.7,34.86 | v30.1,5.46 29.34,6.22 29.34,8 30.34,9 C20.1 | C36.1 58.54,39.09 U1.4 | v54.86,10.79 53.81,11.85 R31.2 | C7.1 19.81,27.91 | R49.2 C23.1 | C40.2 57.15,36.83
  Bottom 0.61: U$6.8 18.54,12.45 17.14,13.84 17.14,17.64 C23.1 | v30.99,20.45 30.99,22.61 28.96,24.64 26.66,24.64 C15.1 | v30.23,13.59 30.23,10.67 | v54.86,10.79 59.31,10.79 60.33,11.81 60.33,19.18 59.44,20.07 57.91,20.07 57.15,20.83 JP2.11
  Bottom 0.813: C26.1 30.63,49.49 R8.2 R7.2 | R1.2 R20.1 30.77,39.2 v29.3,40.68 | 24.11,27.91 24.11,26.7 25.13,25.67 C15.1 | IC2.2 16.88,21.38 C23.1
  Bottom 1.016: C36.1 57.28,38.73 | 57.28,38.73 50.93,38.73 48.96,40.71 42.73,40.71 | JP2.1 57.15,36.83 57.15,38.61 57.28,38.73
  Bottom 1.27: JP2.11 57.13,21.83 | I2C.PIN2 29.3,48.11 C26.1 | IC2.4 19.81,27.91 24.11,27.91 26.67,30.48 26.67,32.89 24.7,34.86 24.51,35.05 v24.51,36.32 | UART.PIN2 42.76,37.82 C30.1 42.73,40.71 41.97,41.47 C29.1 41.97,45.57 USART.PIN2
  pour Bottom (no thermals): 26.29,25.78 27.05,25.78 27.05,24.26 26.29,24.26
  pour Bottom (no thermals): 29.97,11.43 30.61,11.43 30.61,9.78 30.86,9.53 31.5,9.53 31.5,8.51 29.97,8.51
  pour Bottom (no thermals): 41.78,12.32 42.04,12.06 42.04,11.05 42.8,11.05 42.8,12.45 41.78,12.45
  pour Bottom (no thermals): 40.51,26.67 42.29,26.67 42.29,25.91 41.4,25.91 41.15,25.65 40.51,25.65
+5V
  pour Top (isolate 0.254, no thermals): 14.1,46.48 4.06,46.48 3.17,47.37 3.17,55.37 11.68,55.37 12.06,54.99 12.06,52.83 11.68,52.45 7.87,52.45 7.11,51.69 7.11,50.8 7.87,50.04 14.1,50.04
+5V/1  (via drill 0.4, 1.1)  (1 unrouted)
  Top 0.406: U$9.5 18.99,32.58 v19.05,32.64 | U$7.5 22.03,32.58 v22.1,32.51 | U$10.5 24.7,32.58 v24.77,32.51
  Top 1.016: v8.38,13.08 9.65,11.81 9.65,3.94 12.45,1.14 21.21,1.14 22.61,2.54 SV1.2
  Bottom 0.406: C39.1 R21.2 | IC1.2 13.72,33.53 14.99,32.26 18.91,32.26 C42.1 19.05,32.26 | v19.05,32.64 19.05,32.26 | 19.05,32.26 21.84,32.26 v22.1,32.51 v24.77,32.51
  Bottom 0.813: SV1.2 22.61,2.05 C39.1
  Bottom 1.016: IC1.4 13.23,39.75 10.41,39.75 7.11,36.45 7.11,26.16 8.38,24.89 v8.38,13.08
  Bottom 1.27: C24.2 30.1,35.27 ENC.PIN2 30.06,36.36 27.69,38.73 24.38,38.73 23.23,39.89 C6.1 14.06,39.89 IC1.4
+5V/2
  Bottom 0.813: U$5.2 56.09,14.95 R39.2
  pour Top (isolate 0.254, no thermals): 48.77,19.81 48.77,13.72 59.31,13.72 59.94,14.35 59.94,15.62 59.31,16.26 53.21,16.26 51.82,17.65 51.82,19.81
+8V
  pour Top (isolate 0.254, no thermals): 0.76,18.16 0.76,39.5 5.08,39.5 6.6,41.02 9.91,41.02 9.91,35.94 7.11,33.15 7.11,18.29 arc-90 3.94,14.99 arc-90
BOOT0
  Bottom 0.33: STM32F407VG.94 44.11,15.41 R48.2
ENC1_!A
  Bottom 0.61: SV1.5 17.53,6.6 15.88,8.26 15.88,11.56 14.99,12.45 U$6.1 13.59,12.45 13.21,12.06 12.56,12.06 C27.1
ENC1_!B  (via drill 0.6)
  Top 0.61: C28.1 11.68,16.76 v12.06,16.38 12.06,8.38 14.35,6.1 SV1.7
  Bottom 0.61: v12.06,16.38 12.19,16.26 U$6.4
ENC1_A
  Bottom 0.61: SV1.6 18.8,4.83 18.8,6.86 16.89,8.76 16.89,11.94 15.11,13.72 U$6.2 12.53,13.72 R28.2
ENC1_B  (via drill 0.6)
  Top 0.61: SV1.8 13.72,4.83 11.81,4.83 10.92,5.71 v10.92,14.99 R29.2
  Bottom 0.61: v10.92,14.99 U$6.3
GND  (via drill 0.4)
  other vias: 31.11,12.83 32.13,6.86 32.13,7.87 35.56,6.73 39.62,8 31.75,0.89 40.64,31.75 42.42,31.75 42.42,29.08 44.07,38.23 32.38,20.83 33.91,20.83 35.31,20.83 36.7,20.83 33.02,16.51 33.02,15.24 38.1,13.97 39.37,13.97 35.56,15.24 30.1,6.6 22.73,0.89 24.13,3.81 10.16,1.27 7.62,1.27 0.89,7.87 1.27,41.91 2.54,40.64 2.54,43.18 5.08,41.91 6.35,43.18 5.08,44.45 6.35,45.72 2.54,45.72 1.27,44.45 1.27,46.99 1.27,49.02 24.13,49.53 26.67,49.53 29.21,49.53 25.4,48.26 24.13,46.99 24.13,44.45 24.13,41.91 35.56,46.99 36.83,45.72 38.1,46.99 38.1,44.45 43.18,48.26 41.91,49.53 44.45,49.53 46.99,49.53 49.53,49.53 49.53,46.99 48.26,48.26 45.72,48.26 46.61,42.93 50.8,40.64 53.34,36.83 55.88,36.83 52.07,35.56 60.71,39.12 53.34,19.05 59.05,19.05 55.12,12.32 54.61,7.62 45.85,9.4 54.48,4.06 50.8,3.81 49.53,3.81 58.42,6.35 27.94,33.02 27.94,31.75 28.96,28.83 25.4,31.75 11.3,35.81 14.61,35.81 8.51,33.02 8.38,29.84 12.7,31.75 14.35,31.75 20.7,36.96 20.32,41.91 19.05,41.91 19.05,43.18 20.32,43.18 6.35,7.62 7.62,8.89 7.62,6.35 7.62,3.81 12.06,18.16 33.02,40.64 31.75,40.64 34.29,40.64 30.48,38.1 27.69,40.64 13.21,29.84 14.61,37.97 17.53,33.53 20.57,33.53 23.62,33.53 57.4,55.24 12.95,55.24 19.81,55.24 27.43,55.24 34.92,55.24 42.8,55.24 50.16,55.24 26.29,0.89 25.65,11.94 28.19,14.35 16,14.22 18.16,14.22 9.53,18.16 13.21,8.89 13.21,10.67 9.53,20.57 56.26,19.05 49.91,24.13 49.91,26.16 50.29,30.73 52.96,33.53 50.04,41.78 35.81,29.59 33.15,28.45 42.42,30.48 31.37,33.78 33.78,33.78 33.78,37.72 2.29,55.37 0.76,55.24 0.76,52.58 26.92,6.35 9.91,34.42 14.22,7.62 8.13,11.43 0.89,13.46 6.86,13.59 36.2,31.5 40.13,37.97 37.59,42.93 33.02,44.07 30.61,44.07 60.71,36.83 15.88,47.5 19.94,46.61 19.43,38.73 17.78,11.81 46.61,18.67 45.85,8 53.47,11.05 60.58,10.79 55.63,23.11 55.63,25.65 55.63,28.19 55.63,30.73 55.63,33.27 52.96,9.27 45.72,1.02 57.15,0.89 56.26,48.9 52.45,6.6 53.98,1.52 34.04,17.91 40.89,8 39.24,33.15 44.58,43.43 43.31,26.29 33.91,31.5
  pour Bottom (rank 6, no thermals): -0.13,-0.13 -0.13,56.13 61.59,56.13 61.59,-0.13
  pour Top (isolate 0.254, rank 6, no thermals): -0.13,-0.13 -0.13,56.13 61.59,56.13 61.59,-0.13
M1+  (2 unrouted)
  pour Top (isolate 0.254, no thermals): 21.84,5.21 21.84,11.05 22.73,11.05 23.11,11.43 23.11,16.51 23.62,16.51 23.62,11.43 24,11.05 27.69,11.05 28.07,11.43 28.07,12.83 28.57,12.83 28.57,9.14 26.04,6.6 26.04,5.21 25.53,4.7 22.35,4.7
M1-  (2 unrouted)
  pour Top (isolate 0.254, rank 2, no thermals): 14.1,12.83 14.1,8.89 16.13,6.86 16.13,2.92 16.89,2.16 20.45,2.16 21.34,3.05 21.34,11.05 19.94,11.05 19.56,11.43 19.56,16.76 19.05,16.76 19.05,11.43 18.67,11.05 14.99,11.05 14.61,11.43 14.61,12.83
N$1
  Bottom 0.813: R20.2 32.56,37.46 ENC.PIN3 32.51,35.26 R25.2
N$2  (via drill 0.4)
  Top 0.33: 53.59,10.04 v53.85,9.91 53.59,10.16 50.61,10.16 OKL-T/6-W12N-C1.6
  Bottom 0.33: v53.85,9.91 56.09,9.91 R3.2
N$3
  Top 0.406: R4.2 LED.2
N$4
  Top 0.406: R5.2 50.54,27.43 LED.3
N$5
  Top 0.406: R6.2 50.54,29.72 LED.1
N$6
  Top 0.61: U$2.- 32.67,13.59 36.2,13.59 N_FET.3
N$7
  Bottom 0.33: STM32F407VG.73 39.54,27.24 C16.1
N$8
  Top 0.61: R23.1 32.6,17.75 U$2.+
N$9  (1 unrouted)
N$10
  Bottom 0.406: R3.1 R13.1
N$11
  Top 0.406: N_FET.1 37.05,15.58 R2.1 36.66,17.4 R24.1
N$12
  Bottom 0.61: R28.1 10.55,13.44 C27.2
N$13
  Top 0.61: OKL-T/6-W12N-C.6 18.22,48.13 R15.2
N$14
  Bottom 0.406: R13.2 R14.1
N$15
  Top 0.406: R12.1 32.89,5.63 3.3V.A
N$16
  cutout Top: 0,7 3.5,7 arc-90 7,3.5 7,0 0,0
  cutout Bottom: 7,0 7,3.5 arc90 3.5,7 0,7 0,0
N$17
  Top 0.406: U$7.4 19.92,32.02 20.19,31.75 21.08,31.75 21.34,31.5 U$11.8
N$18  (via drill 0.4)
  Top 0.406: v51.18,48.9 50.93,48.64 50.93,44.32 51.31,43.94 X2.3
  Bottom 0.406: v51.18,48.9 51.69,48.9 52.04,48.55 U1.15
N$19
  Bottom 0.813: R1.1 ENC.PIN4 35.05,35.3 R26.2
N$20  (via drill 0.4)
  Top 0.406: v50.16,45.85 50.16,44.07 51.09,43.14 X2.2
  Bottom 0.406: v50.16,45.85 50.29,45.97 52.32,45.97 52.69,46.34 U1.16
N$21
  Top 0.61: R15.1 22.19,46.78 R16.1
N$22
  Top 0.406: U$9.4 16.88,32.02 17.14,31.75 18.03,31.75 18.34,31.45 U$11.11
N$23
  Top 0.61: R16.2 R17.1
N$24  (via drill 0.4)
  Top 0.406: OKL-T/6-W12N-C.10 16.45,37.85 v16.76,37.85 | v23.37,45.97 23.24,45.85 23.24,40.77 20.57,38.1 20.32,38.1 v20.19,37.97
  Bottom 0.406: v16.76,37.85 20.07,37.85 v20.19,37.97 | R18.2 22.23,49.4 23.37,48.26 v23.37,45.97
N$25
  Bottom 0.33: STM32F407VG.49 25.55,23.91 C22.2
N$26  (via drill 0.4)
  Top 0.406: v26.54,2.03 27.56,1.02 29.97,1.02 30.86,1.91 5V.A
  Bottom 0.406: R21.1 v26.54,2.03
N$29
  Top 0.406: R27.1 VDD.A
N$30
  Top 0.61: R29.1 8.14,15.01 C28.2
N$31
  Top 0.33: R19.2 37.37,12.31 OKL-T/6-W12N-C1.10
N$32
  Top 0.406: U$10.4 22.97,32.02 23.24,31.75 24,31.75 24.34,31.42 U$11.5
N$33
  Bottom 0.61: R39.1 55.59,17.14 FET1.3
  Bottom 0.813: U$5.3 55.97,17.45 R39.1
N$35
  cutout Top: 58,0 58,3.5 arc-90 61.5,7 61.5,0
  cutout Bottom: 58,56 58,52.5 arc90 61.5,49 61.5,56
N$36
  cutout Top: 58,56 58,52.5 arc90 61.5,49 61.5,56
  cutout Bottom: 58,0 58,3.5 arc-90 61.5,7 61.5,0
N$37
  Bottom 0.61: R30.2 52.11,13 R31.1 52.09,14.63 FET1.1
N$38  (via drill 3)
  other vias: 3.5,3.5
N$39  (via drill 3)
  other vias: 61.5,3.5
N$40
  Bottom 0.406: R18.1 10.2,49.4 U$1.1
N$43  (via drill 3)
  other vias: 61.5,52.5
N$47
  Bottom 0.61: U$6.7 21.17,13.72 R32.2
N$48
  Bottom 0.61: U$6.6 22.23,14.99 23.24,13.97 R33.2
NRST  (via drill 0.4)
  Top 0.33: 49.77,5.71 C37.2 47.1,5.47 45.72,6.86 v45.47,6.86
  Top 0.406: RESET.1 53.19,5.28 | C37.2 50.93,5.47 R22.1 51.05,5.28 RESET.2 53.19,5.28 | U$3.4 53.19,5.28
  Bottom 0.33: STM32F407VG.14 34.04,9.39 34.67,8.76 34.67,6.48 35.56,5.59 44.2,5.59 v45.47,6.86
PA1
  Bottom 0.33: JP1.4 52.83,25.15 52.83,22.73 49.53,19.43 49.53,6.48 46.61,3.56 34.54,3.56 33.4,4.7 29.84,4.7 28.7,5.84 28.7,8.26 29.04,8.6 STM32F407VG.24
PA2
  Bottom 0.33: JP1.5 54.23,24.38 53.34,23.5 53.34,22.48 50.04,19.18 50.04,6.22 46.86,3.05 34.29,3.05 33.15,4.19 29.59,4.19 28.19,5.59 28.19,8.51 28.54,8.86 STM32F407VG.25
PA3
  Bottom 0.33: STM32F407VG.26 27.46,12.41 27.69,12.19 27.69,5.33 29.34,3.68 32.89,3.68 34.04,2.54 47.12,2.54 50.55,5.97 50.55,18.92 53.47,21.84 JP1.6
PA6  (via drill 0.4)
  Top 0.33: v46.99,1.52 47.88,0.64 55.37,0.64 v56.77,2.03
  Bottom 0.33: STM32F407VG.31 24.69,14.91 24.26,14.48 24.26,11.05 26.04,9.27 26.04,6.22 29.08,3.17 32.64,3.17 33.78,2.03 46.48,2.03 v46.99,1.52 | v56.77,2.03 56.77,5.59 56.01,6.35 53.98,6.35 52.2,8.26 R30.1 52.36,11.05
PA7  (via drill 0.4)
  Top 0.33: v34.29,19.18 34.84,19.18 R24.2
  Bottom 0.33: STM32F407VG.32 29,15.41 32.77,19.18 v34.29,19.18
PA8  (via drill 0.4)
  Top 0.33: v36.83,35.18 36.83,35.94 36.2,36.58 36.2,41.53 34.92,42.8 32.89,42.8 31.8,43.9 I2C.PIN3
  Bottom 0.33: STM32F407VG.67 36.54,28.16 37.47,29.08 37.47,34.54 v36.83,35.18
  Bottom 0.813: R8.1 31.8,47.74 I2C.PIN3
PA9  (via drill 0.4)
  Top 0.33: USART.PIN3 44.5,44.62 42.93,43.05 38.99,43.05 37.21,41.27 37.21,37.59 v37.72,37.08
  Bottom 0.33: STM32F407VG.68 37.04,27.9 37.97,28.83 37.97,36.83 v37.72,37.08
PA10  (via drill 0.4)
  Top 0.33: USART.PIN4 47,44.58 44.96,42.55 39.24,42.55 37.97,41.27 v37.97,38.1
  Bottom 0.33: STM32F407VG.69 37.54,27.64 38.48,28.57 38.48,37.59 v37.97,38.1
PB2
  Bottom 0.33: STM32F407VG.37 25.24,17.91 R49.1
PB3  (via drill 0.4)
  Top 0.33: U$7.3 19.92,34.91 20.32,35.31 21.59,35.31 22.35,36.07 22.35,37.85 v26.29,41.78 | v50.29,37.21 47.5,40.01 v40.77,40.01
  Bottom 0.33: v50.29,37.21 50.29,33.66 48.01,31.37 48.01,24.13 45.34,21.46 45.34,20.07 44.7,19.43 44.7,18.67 43.95,17.91 STM32F407VG.89 | v26.29,41.78 27.3,42.8 35.69,42.8 38.48,40.01 v40.77,40.01
PB4  (via drill 0.4)
  Top 0.33: U$9.3 16.88,35.04 17.14,35.31 19.56,35.31 20.19,35.94 21.08,35.94 21.72,36.58 21.72,38.1 25.4,41.78 25.4,42.42 v25.78,42.8 | v40.13,40.77 48.26,40.77 51.05,37.97 v51.05,36.58
  Bottom 0.33: v40.13,40.77 38.48,40.77 35.94,43.31 26.29,43.31 v25.78,42.8 | v51.05,36.58 51.05,33.66 48.51,31.11 48.51,23.88 45.85,21.21 45.85,19.81 45.21,19.18 45.21,18.29 44.34,17.41 STM32F407VG.90
PB5  (via drill 0.4)
  Top 0.33: v40.13,39.24 47.12,39.24 51.94,34.42 v51.94,34.29 | U$10.3 22.97,37.32 v26.29,40.64
  Bottom 0.33: v51.94,34.29 51.94,33.78 49.02,30.86 49.02,23.62 46.35,20.95 46.35,19.56 45.72,18.92 45.72,17.91 44.73,16.91 STM32F407VG.91 | v26.29,40.64 27.94,42.29 35.43,42.29 38.48,39.24 v40.13,39.24
PB6  (via drill 0.4)
  Top 0.33: v44.58,1.27 44.58,5.97 44.7,6.1 44.7,6.86 v44.58,6.99
  Bottom 0.33: R32.1 21.21,11.05 21.84,10.41 23.11,10.41 25.02,8.51 25.02,5.71 28.57,2.16 32.13,2.16 33.27,1.02 42.67,1.02 43.18,0.51 43.94,0.51 44.58,1.14 v44.58,1.27 | STM32F407VG.92 45.56,16.41 46.23,15.75 46.23,10.92 45.09,9.78 45.09,7.49 v44.58,6.99
PB7  (via drill 0.4)
  Top 0.33: v43.94,6.35 43.56,5.97 v43.56,1.27
  Bottom 0.33: v43.56,1.27 43.31,1.52 33.53,1.52 32.38,2.67 28.83,2.67 25.53,5.97 25.53,8.89 23.62,10.79 23.62,11.6 R33.1 | STM32F407VG.93 45.3,15.91 45.72,15.49 45.72,11.18 44.32,9.78 44.32,7.75 43.81,7.24 43.81,6.48 v43.94,6.35
PC1
  Bottom 0.33: STM32F407VG.16 33.04,9.63 34.16,8.51 34.16,6.22 35.31,5.08 45.85,5.08 48.01,7.24 48.01,20.19 51.31,23.5 51.31,25.91 52.32,26.92 52.32,31.62 53.98,33.27 53.98,33.91 JP1.1
PC2
  Bottom 0.33: STM32F407VG.17 32.54,9.37 33.66,8.26 33.66,5.97 35.05,4.57 46.1,4.57 48.51,6.99 48.51,19.94 51.82,23.24 51.82,25.65 52.83,26.67 52.83,30.23 JP1.2
PC3
  Bottom 0.33: STM32F407VG.18 32.04,9.1 33.15,8 33.15,5.71 34.8,4.06 46.35,4.06 49.02,6.73 49.02,19.68 52.32,22.99 52.32,25.4 53.34,26.42 53.34,28.19 JP1.3
PC6
  Bottom 0.33: STM32F407VG.63 34.54,29.38 R25.1
PC7
  Bottom 0.33: R26.1 STM32F407VG.64
PC9  (via drill 0.4)
  Top 0.33: v36.7,33.91 37.59,34.8 37.59,36.07 36.7,36.96 36.7,42.55 34.3,44.95 I2C.PIN4
  Bottom 0.33: STM32F407VG.66 36.04,28.68 36.96,29.59 36.96,33.66 v36.7,33.91
  Bottom 0.813: R7.1 I2C.PIN4
PC10
  Bottom 0.33: STM32F407VG.78 43.35,23.41 44.7,24.77 44.7,31.11 45.21,31.62 45.21,35.18 45.26,35.23 UART.PIN3
PC11
  Bottom 0.33: STM32F407VG.79 43.62,22.91 45.21,24.51 45.21,30.86 47.75,33.4 47.75,35.18 47.76,35.19 UART.PIN4
PD3  (via drill 0.4)
  Top 0.33: v46.48,28.32 46.74,28.57 R4.1
  Bottom 0.33: STM32F407VG.84 43.4,20.41 43.81,20.83 43.81,22.23 45.72,24.13 45.72,27.56 v46.48,28.32
PD4  (via drill 0.4)
  Top 0.33: v46.48,26.8 47.12,27.43 R5.1
  Bottom 0.33: STM32F407VG.85 43.66,19.91 44.32,20.57 44.32,21.97 46.35,24 46.35,26.67 v46.48,26.8
PD7  (via drill 0.4)
  Top 0.33: v47.12,29.72 R6.1
  Bottom 0.33: v47.12,29.72 47.5,29.34 47.5,24.38 44.83,21.72 44.83,20.32 44.2,19.68 44.2,19.05 43.56,18.41 STM32F407VG.88
PD8  (via drill 0.4)
  Top 0.33: v30.35,28.96 32.38,28.96 32.77,29.34 32.77,31.62 33.53,32.38 37.21,32.38 38.73,33.91 38.73,36.2 39.24,36.7 39.24,41.02 39.75,41.53 48.26,41.53 v48.9,42.16
  Bottom 0.33: STM32F407VG.55 30.54,28.77 v30.35,28.96 | U1.5 57.89,42.32 56.9,43.31 50.04,43.31 v48.9,42.16
PD9  (via drill 0.4)
  Top 0.33: v32,29.72 32,31.75 33.15,32.89 36.96,32.89 38.23,34.16 38.23,36.45 38.73,36.96 38.73,41.27 39.5,42.04 47.37,42.04 v48.01,42.67
  Bottom 0.33: STM32F407VG.56 31.04,28.76 v32,29.72 | v48.01,42.67 49.15,43.81 59.82,43.81 60.49,43.15 U1.1
PE2  (via drill 0.4)
  Top 0.33: C3.2 42.53,7.11 v42.42,7.11
  Top 0.406: SW1.2 SW1.1 42.48,6.73
  Top 0.61: 42.48,6.73 C3.2
  Bottom 0.33: STM32F407VG.1 40.54,10 40.77,9.78 43.05,9.78 43.31,9.53 43.31,8.38 42.2,7.28 42.16,7.11 v42.42,7.11
  Bottom 0.406: 42.25,7.15 42.2,7.28 R10.1
PE3  (via drill 0.4)
  Top 0.406: SW2.2 SW2.1 38.92,6.73 | C4.2 v39.12,6.73
  Top 0.61: 38.92,6.73 C4.2
  Bottom 0.33: STM32F407VG.2 40.04,11.6 40.26,11.81 40.89,11.81 41.27,11.43 41.27,10.79 41.66,10.41 43.18,10.41 43.81,9.78 43.81,8 43.18,7.37 43.18,6.6 42.8,6.22 41.02,6.22 40.51,6.73 v39.12,6.73
  Bottom 0.406: v39.12,6.73 38.7,7.15 R9.1
PH0  (via drill 0.4)
  Top 0.33: Q1.1 34.67,11.14 v34.67,12.57
  Top 0.406: C19.1 35.42,10.14 Q1.1
  Bottom 0.33: STM32F407VG.12 35.04,12.2 v34.67,12.57
PH1  (via drill 0.4)
  Top 0.33: Q1.2 31.24,10.51 31.24,10.79 v32.89,12.45
  Top 0.406: C18.1 30.62,9.89 Q1.2
  Bottom 0.33: STM32F407VG.13 34.54,11.56 33.78,12.32 33.02,12.32 v32.89,12.45
SWCLK  (via drill 0.4)
  Top 0.33: v51.56,30.99 50.04,32.51 v44.32,32.51 | U$3.1 45.51,5.84 v45.47,5.84
  Bottom 0.33: v45.47,5.84 45.85,5.84 47.5,7.49 47.5,20.45 50.8,23.75 50.8,26.16 51.82,27.18 51.82,30.73 v51.56,30.99 | v44.32,32.51 44.2,32.38 44.2,25.02 43.59,24.41 STM32F407VG.76
SWDIO  (via drill 0.4)
  Top 0.33: v53.34,20.57 53.09,20.83 53.09,31.88 v49.53,35.56
  Bottom 0.33: U$3.3 51.69,9.27 51.05,9.91 51.05,18.67 52.96,20.57 v53.34,20.57 | STM32F407VG.72 39.04,31.8 40.51,33.27 43.31,33.27 44.07,34.04 44.07,36.83 45.21,37.97 48.13,37.97 49.53,36.58 v49.53,35.56
VDD  (via drill 1.3)
  Top 0.406: R27.2 29.21,7.58 29.21,14.86 29.84,15.49 29.84,23.37 29.72,23.5
  Top 0.61: U$11.23 21.34,23.88 21.59,24.13
  Top 1.27: 10.63,24.73 v12.19,24
  Top 1.93: v11.43,29.84 11.43,27.81 11.3,27.69
  Bottom 1.27: IC2.3 14.24,21.7 C33.1 12.18,21.72 12.19,21.84 | v11.43,29.84 11.43,31.75 C32.1 11.41,33.93 IC1.3
  Bottom 1.524: v12.19,24 12.19,21.84
  pour Top (isolate 0.254, no thermals): 15.49,28.96 9.14,28.96 9.14,21.84 37.47,21.84 38.48,20.83 38.48,18.41 43.18,18.41 43.18,24.64 40.26,27.56 28.57,27.56 26.67,29.46 26.67,31.11 26.04,31.11 26.04,29.46 25.53,28.96 17.14,28.96 16.64,29.46 16.64,31.11 16,31.11 16,29.46
VUSB  (via drill 0.4)
  Top 0.406: v49.4,44.58 49.4,43.81 50.88,42.34 X2.1
  Bottom 0.406: C35.1 55.29,48.71 U1.20 55.29,45.63 54.23,44.58 v49.4,44.58

### Text on the board
tPlace: RasPI | I2C | USART | ENC | UART | GND | PC1 | PC2 | PC3 | PA1 | PA2 | PA3 | SERVO | MAXON
bPlace: Designed by 翔平